# EAGLE design Arduino0 (EAGLE 6.6.0)
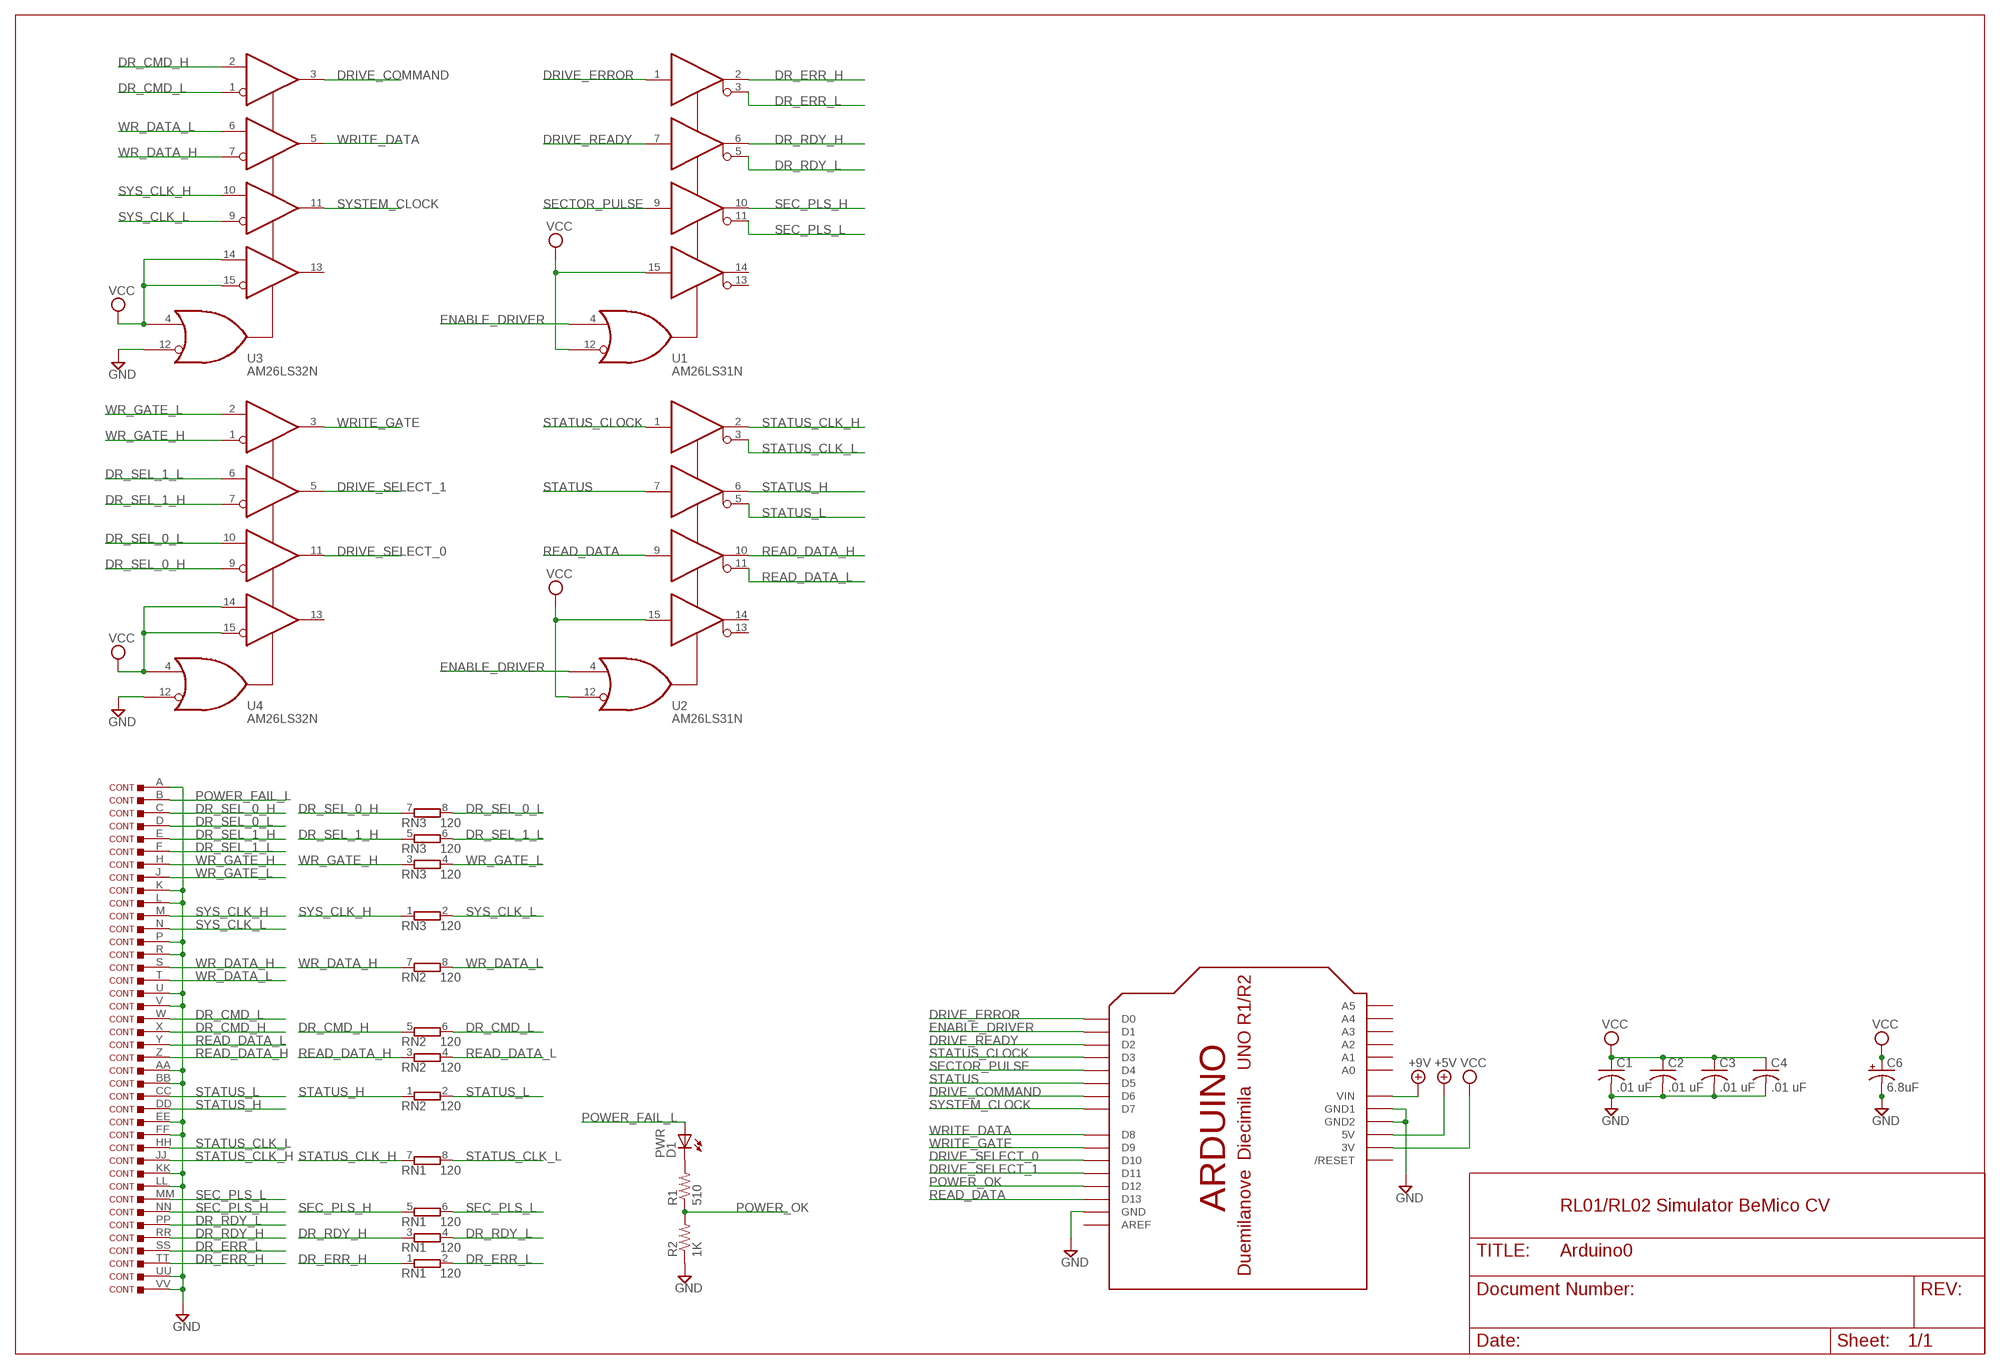
[diagram p0: schematic, sheet 1]

## Parts
C1  .01 uF  C-US050-025X075  [C050-025X075]
C2  .01 uF  C-US050-025X075  [C050-025X075]
C3  .01 uF  C-US050-025X075  [C050-025X075]
C4  .01 uF  C-US050-025X075  [C050-025X075]
C6  6.8uF  CPOL-USE5-5  [E5-5]
CONT  DEC40PINSV  [DEC40PINV]
D1  PWR  LED5MM  [LED5MM]
R1  510  R-US_0207/10  [0207/10]
R2  1K  R-US_0207/10  [0207/10]
RN1  120  E4RP  [SIL8]
RN2  120  E4RP  [SIL8]
RN3  120  E4RP  [SIL8]
U1  AM26LS31N  [DIL16]
U2  AM26LS31N  [DIL16]
U3  AM26LS32N  [DIL16]
U4  AM26LS32N  [DIL16]
U$3  ARDUINOUNO  [ARDUINO]

## Nets
+5V: U$3.5V
+9V: U$3.VIN
DR_CMD_H: CONT.X RN2.5 U3.2(P1)
DR_CMD_L: CONT.W RN2.6 U3.1(N1)
DR_ERR_H: CONT.TT RN1.1 U1.2(Y1)
DR_ERR_L: CONT.SS RN1.2 U1.3(Z1)
DR_RDY_H: CONT.RR RN1.3 U1.6(Y2)
DR_RDY_L: CONT.PP RN1.4 U1.5(Z2)
DR_SEL_0_H: CONT.C RN3.7 U4.9(N3)
DR_SEL_0_L: CONT.D RN3.8 U4.10(P3)
DR_SEL_1_H: CONT.E RN3.5 U4.7(N2)
DR_SEL_1_L: CONT.F RN3.6 U4.6(P2)
DRIVE_COMMAND: U3.3(Y1) U$3.D6
DRIVE_ERROR: U1.1(A1) U$3.D0
DRIVE_READY: U1.7(A2) U$3.D2
DRIVE_SELECT_0: U4.11(Y3) U$3.D10
DRIVE_SELECT_1: U4.5(Y2) U$3.D11
ENABLE_DRIVER: U1.4(G) U2.4(G) U$3.D1
GND [supply]: C1.2 C2.2 C3.2 C4.2 C6.- CONT.A CONT.AA CONT.BB CONT.EE CONT.FF CONT.K CONT.KK CONT.L CONT.LL CONT.P CONT.R CONT.U CONT.UU CONT.V CONT.VV R2.1 U3.12(!G) U4.12(!G) U$3.GND U$3.GND1 U$3.GND2
N$1: D1.K(C) R1.2
N$2: U$3.AREF
N$3: U$3.A5
N$4: U$3.A4
N$5: U$3.A3
N$6: U$3.A2
N$7: U$3.A1
N$8: U$3.A0
N$9: U$3.RESET(/RESET)
POWER_FAIL_L: CONT.B D1.A
POWER_OK: R1.1 R2.2 U$3.D12
READ_DATA: U2.9(A3) U$3.D13
READ_DATA_H: CONT.Z RN2.3 U2.10(Y3)
READ_DATA_L: CONT.Y RN2.4 U2.11(Z3)
SEC_PLS_H: CONT.NN RN1.5 U1.10(Y3)
SEC_PLS_L: CONT.MM RN1.6 U1.11(Z3)
SECTOR_PULSE: U1.9(A3) U$3.D4
STATUS: U2.7(A2) U$3.D5
STATUS_CLK_H: CONT.JJ RN1.7 U2.2(Y1)
STATUS_CLK_L: CONT.HH RN1.8 U2.3(Z1)
STATUS_CLOCK: U2.1(A1) U$3.D3
STATUS_H: CONT.DD RN2.1 U2.6(Y2)
STATUS_L: CONT.CC RN2.2 U2.5(Z2)
SYS_CLK_H: CONT.M RN3.1 U3.10(P3)
SYS_CLK_L: CONT.N RN3.2 U3.9(N3)
SYSTEM_CLOCK: U3.11(Y3) U$3.D7
VCC [supply]: C1.1 C2.1 C3.1 C4.1 C6.+ U1.12(!G) U1.15(A4) U2.12(!G) U2.15(A4) U3.4(G) U3.14(P4) U3.15(N4) U4.4(G) U4.14(P4) U4.15(N4) U$3.3V
WR_DATA_H: CONT.S RN2.7 U3.7(N2)
WR_DATA_L: CONT.T RN2.8 U3.6(P2)
WR_GATE_H: CONT.H RN3.3 U4.1(N1)
WR_GATE_L: CONT.J RN3.4 U4.2(P1)
WRITE_DATA: U3.5(Y2) U$3.D8
WRITE_GATE: U4.3(Y1) U$3.D9
Unconnected: U1.13(Z4) U1.14(Y4) U2.13(Z4) U2.14(Y4) U3.13(Y4) U4.13(Y4)

## Notes on the sheet
- RL01/RL02 Simulator BeMico CV

## Power pins joined to a net without a drawn wire
GND: U1.8(GND) U2.8(GND) U3.8(GND) U4.8(GND)
VCC: U1.16(VCC) U2.16(VCC) U3.16(VCC) U4.16(VCC)

## Library data of the parts
C1-C4 = rcl:C-US: CAPACITOR, American symbol
C6 = rcl:CPOL-US: POLARIZED CAPACITOR, American symbol
CONT = dec-con:DEC40PINS: 40 pin ribbon connector for BC08, BC11 cables.
D1 = led:LED: LED OSRAM: - CHIPLED LG R971, LG N971, LY N971, LG Q971, LY Q971, LO R971, LY R971 LH N974, LH R974 LS Q976, LO Q976, LY Q976 LO Q996 - Hyper CHIPLED LW Q18S LB Q993, LB Q99A, LB R99A - SideLED LS A670, LO A670, LY A670, LG A670, LP A670 LB A673, LV A673, LT A673, LW A673 LH A674 LY A675 LS A676, LA A676, LO A676, LY A676, LW A676 LS A679, LY A679, LG A679 - Hyper Micro SIDELED® LS Y876, LA Y876, LO Y876, LY Y876 LT Y87S - SmartLED LW L88C, LW L88S LB L89C, LB L89S, LG L890 LS L89K, LO L89K, LY L89K LS L896, LA L896, LO L896, LY L896 - TOPLED LS T670, LO T670, LY T670, LG T670, LP T670 LSG T670, LSP T670, LSY T670, LOP T670, LYG T670 LG T671, LOG T671, LSG T671 LB T673, LV T673, LT T673, LW T673 LH T674 LS T676, LA T676, LO T676, LY T676, LB T676, LH T676, LSB T676, LW T676 LB T67C, LV T67C, LT T67C, LS T67K, LO T67K, LY T67K, LW E67C LS E67B, LA E67B, LO E67B, LY E67B, LB E67C, LV E67C, LT E67C LW T67C LS T679, LY T679, LG T679 LS T770, LO T770, LY T770, LG T770, LP T770 LB T773, LV T773, LT T773, LW T773 LH T774 LS E675, LA E675, LY E675, LS T675 LS T776, LA T776, LO T776, LY T776, LB T776 LHGB T686 LT T68C, LB T68C - Hyper Mini TOPLED® LB M676 - Mini TOPLED Santana® LG M470 LS M47K, LO M47K, LY M47K Source: http://www.osram.convergy.de LUXEON: - LUMILED® LXK2-PW12-R00, LXK2-PW12-S00, LXK2-PW14-U00, LXK2-PW14-V00 LXK2-PM12-R00, LXK2-PM12-S00, LXK2-PM14-U00 LXK2-PE12-Q00, LXK2-PE12-R00, LXK2-PE12-S00, LXK2-PE14-T00, LXK2-PE14-U00 LXK2-PB12-K00, LXK2-PB12-L00, LXK2-PB12-M00, LXK2-PB14-N00, LXK2-PB14-P00, LXK2-PB14-Q00 LXK2-PR12-L00, LXK2-PR12-M00, LXK2-PR14-Q00, LXK2-PR14-R00 LXK2-PD12-Q00, LXK2-PD12-R00, LXK2-PD12-S00 LXK2-PH12-R00, LXK2-PH12-S00 LXK2-PL12-P00, LXK2-PL12-Q00, LXK2-PL12-R00 Source: www.luxeon.com KINGBRIGHT: KA-3528ASYC Source: www.kingbright.com
R1 R2 = rcl:R-US_: RESISTOR, American symbol
RN1-RN3 = resistor-sil:E4RP: SIL RESISTOR; OC_FARNELL: unknown; OC_NEWARK: unknown
U1 U2 = dec-con:AM26LS31: Quad RS-422 Driver
U3 U4 = dec-con:AM26LS32: Quad Differential Reciever
U$3 = adafruit:ARDUINO: Arduino Diecimila/Duemilanove Make a shield with ease, this package has all the named pins as well as the two mounting drill holes and an outline of the USB and DC power connector. The outline is on the DIMENSION layer, so if your board house uses it they will cut the outline to match. http://www.ladyada.net/library/pcb/eaglelibrary.html

## Net classes
1 supply: width 0.61 mm

## Board
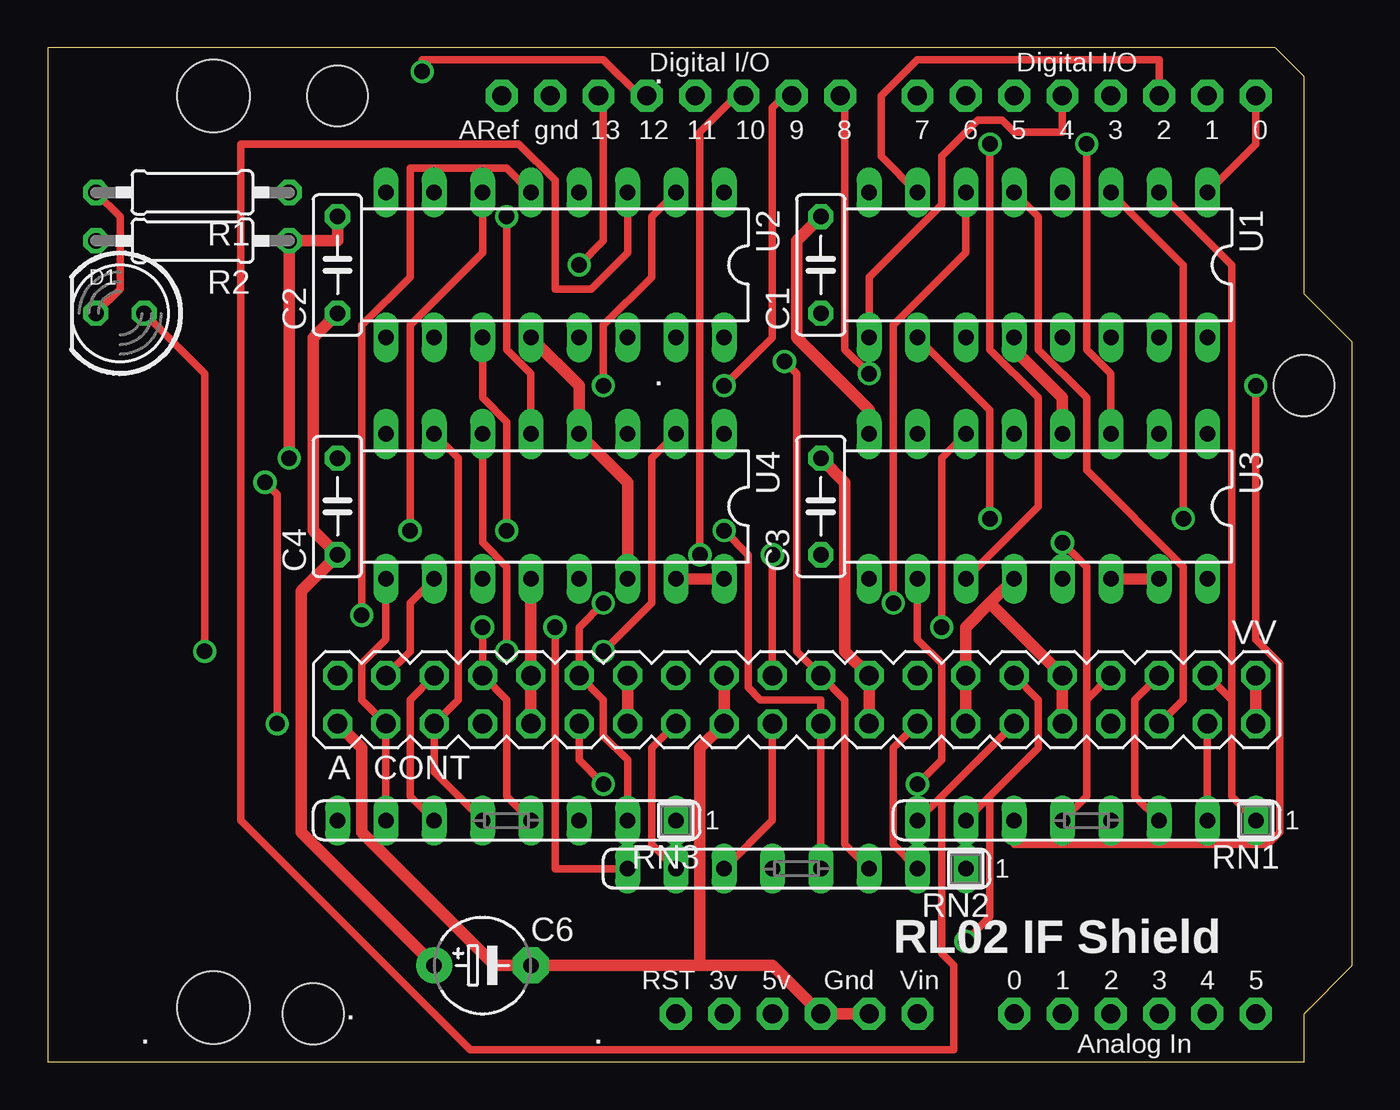
[diagram p1: board, top side]
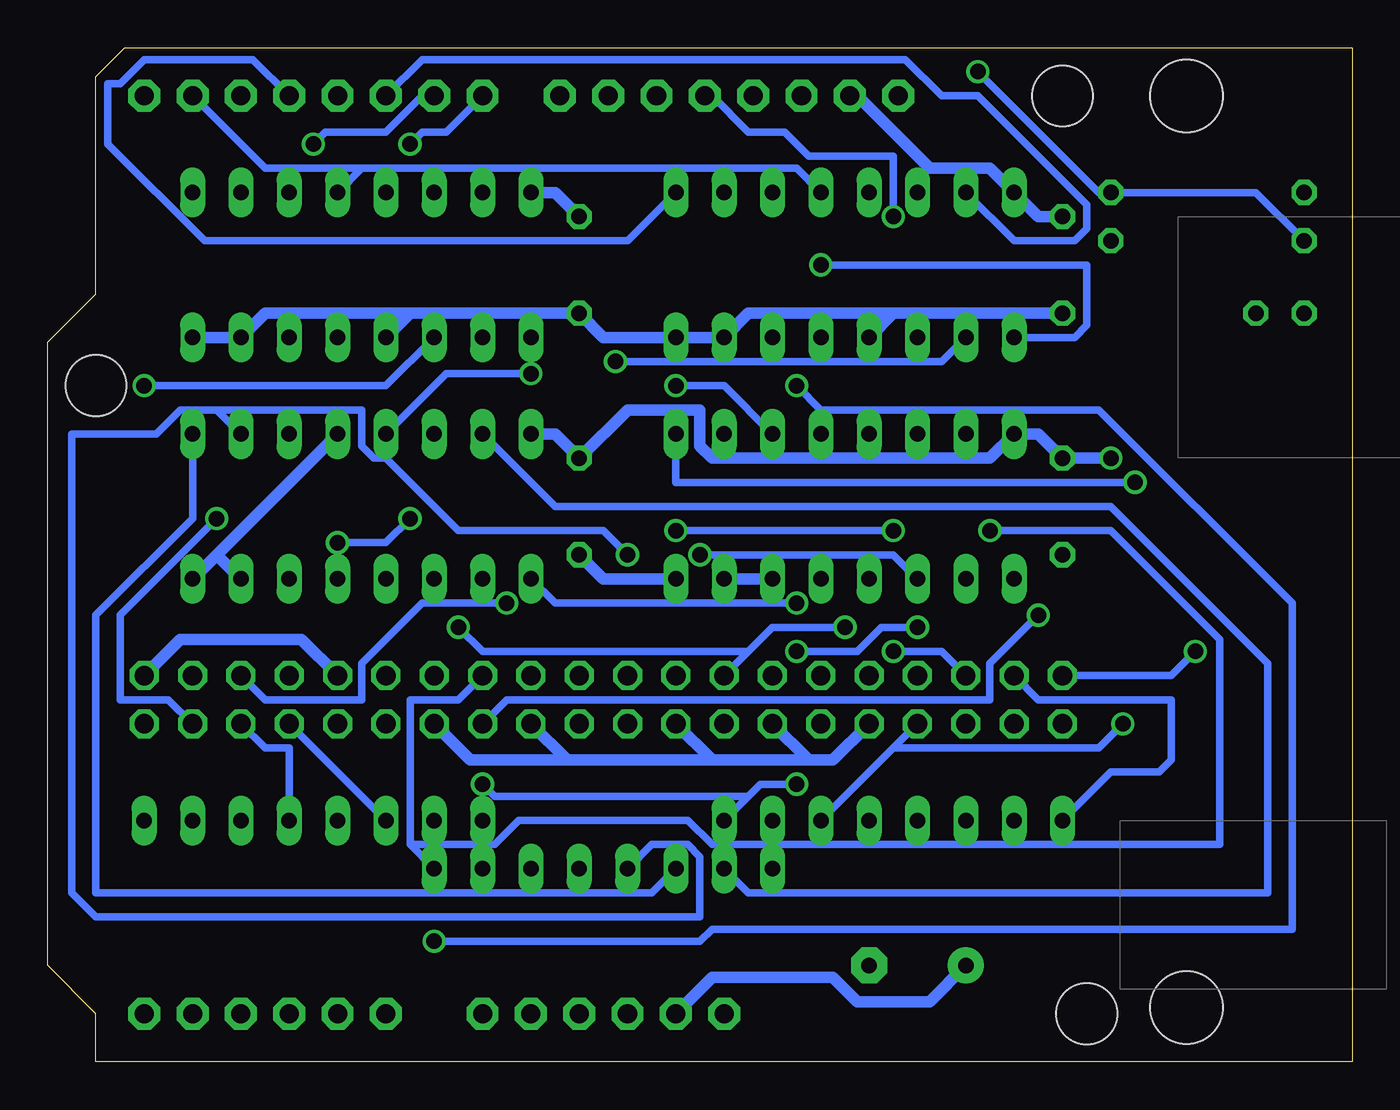
[diagram p2: board, bottom side, seen from below]

Size 68.58 x 53.34 mm. Coordinates in mm from the lower left corner, seen from the top.
Copper layers (1+16): Top 0.035mm / dielectric 1.5mm / Bottom 0.035mm
Design rules "16mils": minimum track width 16mil, minimum drill 32mil, track to track 15mil, track to pad 10mil, pad to pad 10mil, via to via 10mil, smd to smd 10mil, copper to edge 13mil, drill to drill 10mil, minimum pad ring 10mil, minimum via ring 8mil, stop-mask expansion 0mil, vias tented up to drill 0mil, thermal gap 10mil
Holes 3.81 mm at 8.73,50.8 8.73,2.86

### Footprints (pad centres in the part's own frame; a part is rotated, then mirrored left to right if it is on the bottom)
C050-025X075 = drill 0.813 octagon: 1 -2.54,0; 2 2.54,0
E5-5 = drill 0.813 pad 1.905: + -2.54,0 | drill 0.813 pad 1.905 octagon: - 2.54,0
DEC40PINV = drill 1.016 octagon: A -24.13,-1.27; AA 3.81,-1.27; B -24.13,1.27; BB 3.81,1.27; C -21.59,-1.27; CC 6.35,-1.27; D -21.59,1.27; DD 6.35,1.27; E -19.05,-1.27; EE 8.89,-1.27; F -19.05,1.27; FF 8.89,1.27; H -16.51,-1.27; HH 11.43,-1.27; J -16.51,1.27; JJ 11.43,1.27; K -13.97,-1.27; KK 13.97,-1.27; L -13.97,1.27; LL 13.97,1.27; M -11.43,-1.27; MM 16.51,-1.27; N -11.43,1.27; NN 16.51,1.27; P -8.89,-1.27; PP 19.05,-1.27; R -8.89,1.27; RR 19.05,1.27; S -6.35,-1.27; SS 21.59,-1.27; T -6.35,1.27; TT 21.59,1.27; U -3.81,-1.27; UU 24.13,-1.27; V -3.81,1.27; VV 24.13,1.27; W -1.27,-1.27; X -1.27,1.27; Y 1.27,-1.27; Z 1.27,1.27
LED5MM = drill 0.813 octagon: A -1.27,0; K 1.27,0
0207/10 = drill 0.813 octagon: 1 -5.08,0; 2 5.08,0
SIL8 = drill 0.813 long: 1 -8.89,0; 2 -6.35,0; 3 -3.81,0; 4 -1.27,0; 5 1.27,0; 6 3.81,0; 7 6.35,0; 8 8.89,0
DIL16 = drill 0.813 long: 1 -8.89,-3.81; 2 -6.35,-3.81; 3 -3.81,-3.81; 4 -1.27,-3.81; 5 1.27,-3.81; 6 3.81,-3.81; 7 6.35,-3.81; 8 8.89,-3.81; 9 8.89,3.81; 10 6.35,3.81; 11 3.81,3.81; 12 1.27,3.81; 13 -1.27,3.81; 14 -3.81,3.81; 15 -6.35,3.81; 16 -8.89,3.81
ARDUINO = drill 1 pad 1.676 octagon: 3V 35.56,2.54; 5V 38.1,2.54; A0 50.8,2.54; A1 53.34,2.54; A2 55.88,2.54; A3 58.42,2.54; A4 60.96,2.54; A5 63.5,2.54; AREF 23.876,50.8; D0 63.5,50.8; D1 60.96,50.8; D2 58.42,50.8; D3 55.88,50.8; D4 53.34,50.8; D5 50.8,50.8; D6 48.26,50.8; D7 45.72,50.8; D8 41.656,50.8; D9 39.116,50.8; D10 36.576,50.8; D11 34.036,50.8; D12 31.496,50.8; D13 28.956,50.8; GND 26.416,50.8; GND1 43.18,2.54; GND2 40.64,2.54; RESET 33.02,2.54; VIN 45.72,2.54 | hole 3.2: 15.24,50.8; 66.04,35.56; 13.97,2.54

### Placement (x,y rotation side)
C1  40.64,41.91 90 top
C2  15.24,41.91 90 top
C3  40.64,29.21 90 top
C4  15.24,29.21 90 top
C6  22.86,5.08 0 top
CONT  39.37,19.05 0 top
D1  3.81,39.37 180 top
R1  7.62,45.72 180 top
R2  7.62,43.18 180 top
RN1  54.61,12.7 180 top
RN2  39.37,10.16 180 top
RN3  24.13,12.7 180 top
U1  52.07,41.91 180 top
U2  26.67,41.91 180 top
U3  52.07,29.21 180 top
U4  26.67,29.21 180 top
U$3  0,0 0 top

### Tracks (layer width: path | path; a pad name or v marks a point on that pad's centre or on a via)
DR_CMD_H  (via drill 0.81)
  Top 0.406: v38.1,26.67 CONT.X
  Bottom 0.406: RN2.5 36.83,11.43 34.92,11.43 34.29,10.79 34.29,7.62 66.04,7.62 67.31,8.89 67.31,33.02 62.87,33.02 61.59,34.29 59.69,34.29 | U3.2 59.69,34.29 | v38.1,26.67 39.37,27.94 46.99,27.94 50.8,31.75 51.44,31.75 52.07,32.38 52.07,34.29 59.69,34.29
DR_CMD_L
  Top 0.406: RN2.6 38.1,12.7 CONT.W
  Bottom 0.406: U3.1 60.96,28.57 66.04,23.5 66.04,8.89 36.83,8.89 RN2.6
DR_ERR_H
  Top 0.406: RN1.1 62.23,13.97 62.23,19.05 | CONT.TT 62.23,19.05 | U1.2 62.23,41.91 62.23,19.05
DR_ERR_L  (via drill 0.81)
  Top 0.406: U1.3 59.69,41.91 v59.69,28.57 | CONT.SS RN1.2
  Bottom 0.406: v59.69,28.57 64.77,23.5 64.77,19.05 62.23,19.05 CONT.SS
DR_RDY_H  (via drill 0.81)
  Top 0.406: U1.6 48.26,42.55 44.45,38.73 v44.45,24.13 | RN1.3 57.15,13.97 57.15,19.05 CONT.RR
  Bottom 0.406: v44.45,24.13 48.9,24.13 52.07,20.95 52.07,19.05 57.15,19.05 CONT.RR
DR_RDY_L
  Top 0.406: U1.5 52.07,44.45 52.07,37.47 54.61,34.92 54.61,31.11 59.69,26.04 59.69,19.05 CONT.PP
  Bottom 0.406: RN1.4 55.88,16.51 57.15,16.51 CONT.PP
DR_SEL_0_H
  Top 0.406: RN3.7 CONT.C 16.51,19.05 16.51,20.95 17.78,22.23 U4.9
DR_SEL_0_L
  Top 0.406: U4.10 19.05,24.13 19.05,21.59 CONT.D
  Bottom 0.406: RN3.8 12.7,15.24 10.16,15.24 9.53,15.88 9.53,19.05 16.51,19.05 CONT.D
DR_SEL_1_H
  Top 0.406: U4.7 21.59,31.75 21.59,19.05 CONT.E 20.32,15.24 RN3.5
DR_SEL_1_L  (via drill 0.81)
  Top 0.406: RN3.6 19.05,13.97 19.05,19.05 CONT.F | U4.6 22.86,27.3 24.13,26.04 v24.13,21.59
  Bottom 0.406: v24.13,21.59 21.59,21.59 CONT.F
DRIVE_COMMAND  (via drill 0.81)
  Top 0.406: U3.3 55.88,36.2 54.61,37.47 v54.61,48.26
  Bottom 0.406: v54.61,48.26 53.98,48.9 50.8,48.9 48.9,50.8 U$3.D6
DRIVE_ERROR
  Top 0.406: U1.1 63.5,48.26 U$3.D0
DRIVE_READY
  Top 0.406: U1.7 43.81,47.62 43.81,50.8 45.72,52.7 58.42,52.7 U$3.D2
DRIVE_SELECT_0  (via drill 0.81)
  Top 0.406: v34.29,26.67 34.29,48.9 36.2,50.8 U$3.D10
  Bottom 0.406: U4.11 24.13,26.67 v34.29,26.67
DRIVE_SELECT_1  (via drill 0.81)
  Top 0.406: U4.5 25.4,36.2 24.13,37.47 v24.13,44.45
  Bottom 0.406: v24.13,44.45 24.13,47.62 28.57,47.62 29.84,48.9 31.75,48.9 33.66,50.8 U$3.D11
ENABLE_DRIVER
  Bottom 0.406: U2.4 29.21,46.99 52.07,46.99 | U1.4 52.07,46.99 | U$3.D1 57.15,46.99 52.07,46.99
GND  (via drill 0.81)
  Top 0.61: C2.2 15.24,43.18 R2.1 v12.7,31.75 | C1.2 39.37,43.18 39.37,38.1 43.18,34.29 U3.8 | U$3.GND1 U$3.GND2 38.1,5.08 34.29,5.08 | CONT.A 16.51,16.51 16.51,12.06 23.5,5.08 C6.- 34.29,5.08 | CONT.VV CONT.UU | CONT.KK CONT.LL 49.53,24.13 | 49.53,24.13 48.26,22.86 CONT.FF CONT.EE | 49.53,24.13 U3.12 | CONT.AA CONT.BB 41.91,21.59 41.91,30.48 C3.2 | CONT.V CONT.U 34.29,16.51 34.29,5.08 | CONT.R CONT.P | U4.12 CONT.L CONT.K
  Bottom 0.61: C2.2 16.51,44.45 U2.8 19.05,46.99 22.23,46.99 26.04,50.8 U$3.GND | C1.2 41.91,45.72 U1.8 | U3.8 41.91,33.02 C3.2 38.1,34.29 34.29,34.29 34.29,32.38 33.66,31.75 19.05,31.75 U4.8 16.51,33.02 C4.2 v12.7,31.75 | CONT.VV 61.59,22.23 55.24,22.23 CONT.LL | 28.57,15.88 CONT.P | 28.57,15.88 27.3,15.88 CONT.K | 33.66,15.88 CONT.U | 28.57,15.88 33.66,15.88 | 41.27,15.88 CONT.AA | 33.66,15.88 41.27,15.88 | CONT.EE 46.35,15.88 41.27,15.88
N$1
  Top 0.406: D1.K 3.81,40.64 3.81,44.45 R1.2
POWER_FAIL_L  (via drill 0.81)
  Top 0.406: D1.A 8.26,36.2 v8.26,21.59
  Bottom 0.406: v8.26,21.59 9.53,20.32 CONT.B
POWER_OK  (via drill 0.81)
  Top 0.406: v19.68,52.07 19.68,52.7 29.21,52.7 31.11,50.8 U$3.D12
  Bottom 0.406: R2.2 5.08,45.72 R1.1 13.34,45.72 v19.68,52.07
READ_DATA  (via drill 0.81)
  Top 0.406: v27.94,41.91 29.21,43.18 29.21,50.8 U$3.D13
  Bottom 0.406: U2.9 14.61,38.1 13.97,38.73 13.97,41.91 v27.94,41.91
READ_DATA_H  (via drill 0.81)
  Top 0.406: RN2.3 41.91,11.43 41.91,19.05 CONT.Z 39.37,21.59 39.37,36.2 v38.73,36.83
  Bottom 0.406: U2.10 21.59,36.83 v38.73,36.83
READ_DATA_L  (via drill 0.81)
  Top 0.406: U2.11 22.86,34.92 24.13,33.66 v24.13,27.94 | v35.56,27.94 36.83,26.67 36.83,19.68 37.47,19.05 40.64,19.05 CONT.Y RN2.4
  Bottom 0.406: v35.56,27.94 v24.13,27.94
SEC_PLS_H  (via drill 0.81)
  Top 0.406: RN1.5 54.61,13.97 54.61,19.05 | CONT.NN 54.61,19.05 | U1.10 49.53,34.29 v49.53,28.57 | v53.34,27.3 54.61,26.04 54.61,19.05
  Bottom 0.406: v49.53,28.57 50.8,27.3 v53.34,27.3
SEC_PLS_L  (via drill 0.81)
  Top 0.406: v63.5,35.56 63.5,22.23 64.77,20.95 64.77,12.06 64.14,11.43 50.8,11.43 RN1.6
  Bottom 0.406: CONT.MM RN1.6 | U1.11 50.8,35.56 v63.5,35.56
SECTOR_PULSE
  Top 0.406: U1.9 43.18,41.27 46.99,45.09 46.99,47.62 48.9,49.53 50.16,49.53 50.8,48.9 53.34,48.9 U$3.D4
STATUS
  Bottom 0.406: U2.7 17.78,43.18 14.61,43.18 13.97,43.81 13.97,45.09 19.68,50.8 21.59,50.8 23.5,52.7 48.9,52.7 U$3.D5
STATUS_CLK_H  (via drill 0.81)
  Top 0.406: 49.53,13.97 52.07,16.51 52.07,19.05 CONT.JJ | 49.53,13.97 RN1.7 | U2.2 31.75,44.45 31.75,41.27 29.21,38.73 v29.21,35.56 | v48.26,6.35 49.53,7.62 49.53,13.97
  Bottom 0.406: v29.21,35.56 27.94,34.29 13.34,34.29 3.17,24.13 3.17,6.99 33.66,6.99 34.29,6.35 v48.26,6.35
STATUS_CLK_L
  Top 0.406: CONT.HH 46.99,13.97 | 46.99,13.97 RN1.8 | U2.3 30.48,42.55 28.57,40.64 26.67,40.64 26.67,46.35 24.77,48.26 10.16,48.26 10.16,12.7 22.23,0.64 47.62,0.64 47.62,5.08 46.99,5.71 46.99,13.97
STATUS_CLOCK
  Bottom 0.406: U2.1 38.1,43.18 60.33,43.18 65.41,48.26 65.41,51.44 64.77,51.44 63.5,52.7 57.78,52.7 U$3.D3
STATUS_H  (via drill 0.81)
  Top 0.406: U2.6 22.86,42.55 19.05,38.73 v19.05,27.94
  Bottom 0.406: 49.53,11.43 RN2.1 | 49.53,11.43 49.53,19.05 46.99,19.05 CONT.DD | v19.05,27.94 12.7,27.94 6.99,22.23 6.99,11.43 33.66,11.43 34.92,12.7 43.81,12.7 45.09,11.43 49.53,11.43
STATUS_L  (via drill 0.81)
  Top 0.406: U2.5 24.13,46.99 19.05,46.99 19.05,41.27 16.51,38.73 v16.51,23.5 | RN2.2 44.45,11.43 44.45,16.51 CONT.CC
  Bottom 0.406: v16.51,23.5 19.05,20.95 19.05,19.05 44.45,19.05 CONT.CC
SYS_CLK_H  (via drill 0.81)
  Top 0.406: v29.21,14.61 27.94,15.88 CONT.M | U3.10 45.72,22.23 46.99,20.95 46.99,15.88 v45.72,14.61
  Bottom 0.406: 31.75,13.97 31.11,14.61 v29.21,14.61 | 31.75,13.97 RN3.1 | v45.72,14.61 45.09,13.97 31.75,13.97
SYS_CLK_L  (via drill 0.81)
  Top 0.406: RN3.2 30.48,15.88 29.21,17.14 29.21,19.05 CONT.N 27.94,22.86 v29.21,24.13
  Bottom 0.406: U3.9 41.91,24.13 v29.21,24.13
SYSTEM_CLOCK  (via drill 0.81)
  Top 0.406: U3.11 52.07,29.21 52.07,34.92 49.53,37.47 v49.53,48.26
  Bottom 0.406: v49.53,48.26 48.9,48.9 47.62,48.9 U$3.D7
VCC
  Top 0.61: U3.15 U3.14 | U3.4 53.34,34.92 50.8,37.47 U1.12 | C2.1 13.97,38.1 13.97,27.94 C4.1 13.34,24.77 13.34,12.06 C6.+ | U2.12 27.94,35.56 U4.4 30.48,30.48 U4.14 | U4.15 U4.16
  Bottom 0.61: U3.16 59.69,26.67 | 59.69,26.67 U3.4 | 59.69,26.67 U3.15 | U1.16 U1.15 57.15,39.37 49.53,39.37 | 49.53,39.37 U1.12 | 49.53,39.37 C1.1 39.37,38.1 U2.16 U2.15 31.75,39.37 24.13,39.37 | U$3.3V 33.66,4.45 27.3,4.45 26.04,3.17 22.23,3.17 C6.+ | U4.15 U4.14 | C3.1 39.37,25.4 U4.16 | 24.13,39.37 C2.1 | U2.12 24.13,39.37
WR_DATA_H
  Top 0.406: RN2.7 31.75,11.43 31.75,16.51 CONT.S
  Bottom 0.406: U3.7 41.91,29.21 12.7,29.21 4.45,20.95 4.45,8.89 31.75,8.89 RN2.7
WR_DATA_L  (via drill 0.81)
  Top 0.406: RN2.8 26.67,10.16 v26.67,22.86 | U3.6 46.99,31.75 v46.99,22.86
  Bottom 0.406: v26.67,22.86 30.48,22.86 31.75,21.59 | CONT.T 31.75,21.59 | v46.99,22.86 45.72,21.59 31.75,21.59
WR_GATE_H  (via drill 0.81)
  Top 0.406: v11.43,30.48 12.06,29.84 v12.06,17.78
  Bottom 0.406: CONT.H 24.13,16.51 | 24.13,16.51 RN3.3 | U4.1 35.56,30.48 v11.43,30.48 | v12.06,17.78 13.34,16.51 24.13,16.51
WR_GATE_L  (via drill 0.81)
  Top 0.406: RN3.4 24.13,13.97 24.13,19.05 CONT.J v22.86,22.86 | U4.2 31.75,31.75 31.75,24.13 v29.21,21.59
  Bottom 0.406: v29.21,21.59 26.04,21.59 24.77,22.86 v22.86,22.86
WRITE_DATA  (via drill 0.81)
  Top 0.406: v43.18,36.2 41.91,37.47 41.91,50.8 U$3.D8
  Bottom 0.406: U3.5 47.62,36.2 v43.18,36.2
WRITE_GATE  (via drill 0.81)
  Top 0.406: v35.56,35.56 38.1,38.1 38.1,50.16 38.73,50.8 U$3.D9
  Bottom 0.406: U4.3 33.02,35.56 v35.56,35.56

### Text on the board
tNames: . | . | RL02 IF Shield | . | . | .